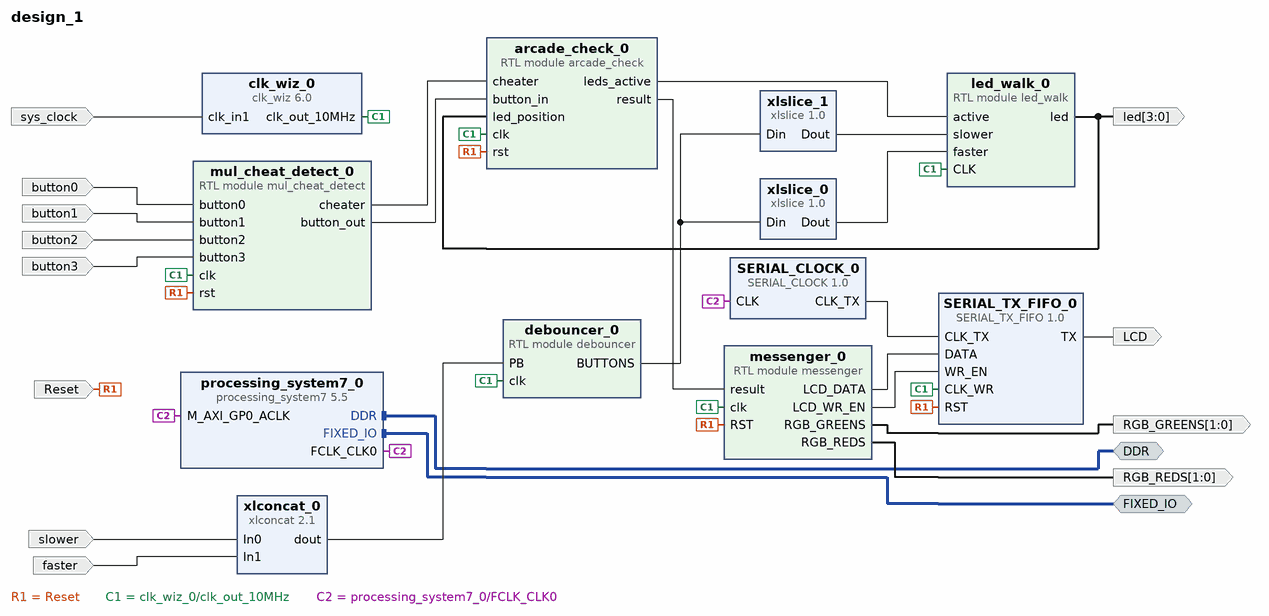
[diagram p0: block diagram of the top level]
# Vivado block design design_1, xc7z020clg400-1, Vivado 2020.1
create_bd_design design_1

create_bd_intf_port -mode Master -vlnv xilinx.com:interface:ddrx_rtl:1.0 DDR
create_bd_intf_port -mode Master -vlnv xilinx.com:display_processing_system7:fixedio_rtl:1.0 FIXED_IO
create_bd_port -dir O -from 3 -to 0 led
create_bd_port -dir I button0
create_bd_port -dir I button1
create_bd_port -dir I button2
create_bd_port -dir I Reset
create_bd_port -dir O -from 1 -to 0 RGB_REDS
create_bd_port -dir O -from 1 -to 0 RGB_GREENS
create_bd_port -dir I button3
create_bd_port -dir O -type data LCD
create_bd_port -dir I -type clk sys_clock
set_property -dict {CONFIG.FREQ_HZ 125000000 CONFIG.PHASE 0.000} [get_bd_ports sys_clock]
create_bd_port -dir I slower
create_bd_port -dir I faster

create_bd_cell -type ip -vlnv xilinx.com:ip:clk_wiz:6.0 clk_wiz_0
set_property -dict [list \
  CONFIG.CLKOUT1_DRIVES BUFG \
  CONFIG.CLKOUT1_JITTER 394.794 \
  CONFIG.CLKOUT1_PHASE_ERROR 258.220 \
  CONFIG.CLKOUT1_REQUESTED_OUT_FREQ 10.000 \
  CONFIG.CLKOUT2_DRIVES BUFG \
  CONFIG.CLKOUT2_JITTER 317.841 \
  CONFIG.CLKOUT2_PHASE_ERROR 249.865 \
  CONFIG.CLKOUT2_REQUESTED_OUT_FREQ 25.000 \
  CONFIG.CLKOUT2_USED false \
  CONFIG.CLKOUT3_DRIVES BUFG \
  CONFIG.CLKOUT3_JITTER 237.312 \
  CONFIG.CLKOUT3_PHASE_ERROR 249.865 \
  CONFIG.CLKOUT3_USED false \
  CONFIG.CLKOUT4_DRIVES BUFG \
  CONFIG.CLKOUT5_DRIVES BUFG \
  CONFIG.CLKOUT6_DRIVES BUFG \
  CONFIG.CLKOUT7_DRIVES BUFG \
  CONFIG.CLK_IN1_BOARD_INTERFACE sys_clock \
  CONFIG.CLK_OUT1_PORT clk_out_10MHz \
  CONFIG.CLK_OUT2_PORT clk_out_25MHz \
  CONFIG.CLK_OUT3_PORT clk_out_100MHz \
  CONFIG.FEEDBACK_SOURCE FDBK_AUTO \
  CONFIG.MMCM_BANDWIDTH OPTIMIZED \
  CONFIG.MMCM_CLKFBOUT_MULT_F 34 \
  CONFIG.MMCM_CLKIN2_PERIOD 10.0 \
  CONFIG.MMCM_CLKOUT0_DIVIDE_F 85 \
  CONFIG.MMCM_CLKOUT1_DIVIDE 1 \
  CONFIG.MMCM_CLKOUT2_DIVIDE 1 \
  CONFIG.MMCM_COMPENSATION ZHOLD \
  CONFIG.MMCM_DIVCLK_DIVIDE 5 \
  CONFIG.NUM_OUT_CLKS 1 \
  CONFIG.PRIMITIVE PLL \
  CONFIG.USE_BOARD_FLOW true \
  CONFIG.USE_LOCKED false \
  CONFIG.USE_RESET false \
] [get_bd_cells clk_wiz_0]
create_bd_cell -type ip -vlnv xilinx.com:user:SERIAL_TX_FIFO:1.0 SERIAL_TX_FIFO_0
create_bd_cell -type ip -vlnv xilinx.com:user:SERIAL_CLOCK:1.0 SERIAL_CLOCK_0
set_property -dict {CONFIG.K 3221 CONFIG.N 20} [get_bd_cells SERIAL_CLOCK_0]
create_bd_cell -type ip -vlnv xilinx.com:ip:processing_system7:5.5 processing_system7_0
set_property -dict [list \
  CONFIG.PCW_APU_PERIPHERAL_FREQMHZ 667 \
  CONFIG.PCW_ENET0_ENET0_IO {MIO 16 .. 27} \
  CONFIG.PCW_ENET0_GRP_MDIO_ENABLE 1 \
  CONFIG.PCW_ENET0_GRP_MDIO_IO {MIO 52 .. 53} \
  CONFIG.PCW_ENET0_PERIPHERAL_ENABLE 1 \
  CONFIG.PCW_ENET0_RESET_ENABLE 0 \
  CONFIG.PCW_ENET_RESET_ENABLE 1 \
  CONFIG.PCW_ENET_RESET_SELECT {Share reset pin} \
  CONFIG.PCW_GPIO_MIO_GPIO_ENABLE 1 \
  CONFIG.PCW_GPIO_MIO_GPIO_IO MIO \
  CONFIG.PCW_I2C_RESET_ENABLE 1 \
  CONFIG.PCW_PRESET_BANK1_VOLTAGE {LVCMOS 1.8V} \
  CONFIG.PCW_QSPI_GRP_FBCLK_ENABLE 1 \
  CONFIG.PCW_QSPI_GRP_FBCLK_IO {MIO 8} \
  CONFIG.PCW_QSPI_GRP_SINGLE_SS_ENABLE 1 \
  CONFIG.PCW_QSPI_GRP_SINGLE_SS_IO {MIO 1 .. 6} \
  CONFIG.PCW_QSPI_PERIPHERAL_ENABLE 1 \
  CONFIG.PCW_QSPI_QSPI_IO {MIO 1 .. 6} \
  CONFIG.PCW_SD0_GRP_CD_ENABLE 1 \
  CONFIG.PCW_SD0_GRP_CD_IO {MIO 47} \
  CONFIG.PCW_SD0_GRP_WP_ENABLE 0 \
  CONFIG.PCW_SD0_PERIPHERAL_ENABLE 1 \
  CONFIG.PCW_SD0_SD0_IO {MIO 40 .. 45} \
  CONFIG.PCW_SDIO_PERIPHERAL_FREQMHZ 50 \
  CONFIG.PCW_SINGLE_QSPI_DATA_MODE x4 \
  CONFIG.PCW_UART1_PERIPHERAL_ENABLE 1 \
  CONFIG.PCW_UART1_UART1_IO {MIO 48 .. 49} \
  CONFIG.PCW_UART_PERIPHERAL_FREQMHZ 100 \
  CONFIG.PCW_UIPARAM_DDR_FREQ_MHZ 533.333333 \
  CONFIG.PCW_UIPARAM_DDR_MEMORY_TYPE {DDR 3 (Low Voltage)} \
  CONFIG.PCW_UIPARAM_DDR_PARTNO {MT41K256M16 RE-125} \
  CONFIG.PCW_USB0_PERIPHERAL_ENABLE 1 \
  CONFIG.PCW_USB0_RESET_ENABLE 1 \
  CONFIG.PCW_USB0_RESET_IO {MIO 46} \
  CONFIG.PCW_USB0_USB0_IO {MIO 28 .. 39} \
  CONFIG.PCW_USB_RESET_ENABLE 1 \
  CONFIG.PCW_USB_RESET_SELECT {Share reset pin} \
] [get_bd_cells processing_system7_0]
# 295 more settings of processing_system7_0 are not shown: defaults, MIO pin electricals, DDR timing, and values the tool derives
create_bd_cell -type ip -vlnv xilinx.com:ip:xlconcat:2.1 xlconcat_0
create_bd_cell -type ip -vlnv xilinx.com:ip:xlslice:1.0 xlslice_0
set_property -dict {CONFIG.DIN_FROM 1 CONFIG.DIN_TO 1 CONFIG.DIN_WIDTH 4} [get_bd_cells xlslice_0]
create_bd_cell -type ip -vlnv xilinx.com:ip:xlslice:1.0 xlslice_1
set_property -dict {CONFIG.DIN_WIDTH 4} [get_bd_cells xlslice_1]
create_bd_cell -type module -reference led_walk led_walk_0
create_bd_cell -type module -reference mul_cheat_detect mul_cheat_detect_0
create_bd_cell -type module -reference arcade_check arcade_check_0
create_bd_cell -type module -reference messenger messenger_0
create_bd_cell -type module -reference debouncer debouncer_0

# ---- connections ----

connect_bd_intf_net [get_bd_intf_ports DDR] [get_bd_intf_pins processing_system7_0/DDR]
connect_bd_intf_net [get_bd_intf_ports FIXED_IO] [get_bd_intf_pins processing_system7_0/FIXED_IO]
connect_bd_net [get_bd_pins led_walk_0/led] [get_bd_ports led] [get_bd_pins arcade_check_0/led_position]
connect_bd_net -net button0_0_1 [get_bd_ports button0] [get_bd_pins mul_cheat_detect_0/button0]
connect_bd_net -net button1_0_1 [get_bd_ports button1] [get_bd_pins mul_cheat_detect_0/button1]
connect_bd_net -net button2_0_1 [get_bd_ports button2] [get_bd_pins mul_cheat_detect_0/button2]
connect_bd_net [get_bd_ports Reset] \
  [get_bd_pins SERIAL_TX_FIFO_0/RST] [get_bd_pins mul_cheat_detect_0/rst] [get_bd_pins arcade_check_0/rst] \
  [get_bd_pins messenger_0/RST]
connect_bd_net [get_bd_pins mul_cheat_detect_0/cheater] [get_bd_pins arcade_check_0/cheater]
connect_bd_net [get_bd_pins arcade_check_0/result] [get_bd_pins messenger_0/result]
connect_bd_net [get_bd_pins messenger_0/RGB_REDS] [get_bd_ports RGB_REDS]
connect_bd_net [get_bd_pins messenger_0/RGB_GREENS] [get_bd_ports RGB_GREENS]
connect_bd_net -net button3_0_1 [get_bd_ports button3] [get_bd_pins mul_cheat_detect_0/button3]
connect_bd_net [get_bd_pins mul_cheat_detect_0/button_out] [get_bd_pins arcade_check_0/button_in]
connect_bd_net [get_bd_pins clk_wiz_0/clk_out_10MHz] \
  [get_bd_pins SERIAL_TX_FIFO_0/CLK_WR] [get_bd_pins led_walk_0/CLK] [get_bd_pins mul_cheat_detect_0/clk] \
  [get_bd_pins arcade_check_0/clk] [get_bd_pins messenger_0/clk] [get_bd_pins debouncer_0/clk]
connect_bd_net [get_bd_pins SERIAL_CLOCK_0/CLK_TX] [get_bd_pins SERIAL_TX_FIFO_0/CLK_TX]
connect_bd_net [get_bd_pins messenger_0/LCD_DATA] [get_bd_pins SERIAL_TX_FIFO_0/DATA]
connect_bd_net [get_bd_pins messenger_0/LCD_WR_EN] [get_bd_pins SERIAL_TX_FIFO_0/WR_EN]
connect_bd_net [get_bd_pins SERIAL_TX_FIFO_0/TX] [get_bd_ports LCD]
connect_bd_net [get_bd_pins arcade_check_0/leds_active] [get_bd_pins led_walk_0/active]
connect_bd_net [get_bd_pins processing_system7_0/FCLK_CLK0] [get_bd_pins processing_system7_0/M_AXI_GP0_ACLK] [get_bd_pins SERIAL_CLOCK_0/CLK]
connect_bd_net [get_bd_ports sys_clock] [get_bd_pins clk_wiz_0/clk_in1]
connect_bd_net [get_bd_ports slower] [get_bd_pins xlconcat_0/In0]
connect_bd_net [get_bd_ports faster] [get_bd_pins xlconcat_0/In1]
connect_bd_net [get_bd_pins xlconcat_0/dout] [get_bd_pins debouncer_0/PB]
connect_bd_net [get_bd_pins debouncer_0/BUTTONS] [get_bd_pins xlslice_1/Din] [get_bd_pins xlslice_0/Din]
connect_bd_net [get_bd_pins xlslice_1/Dout] [get_bd_pins led_walk_0/slower]
connect_bd_net [get_bd_pins xlslice_0/Dout] [get_bd_pins led_walk_0/faster]

validate_bd_design
save_bd_design
